# Altium schematic sheet Sheet1.SchDoc
size A3
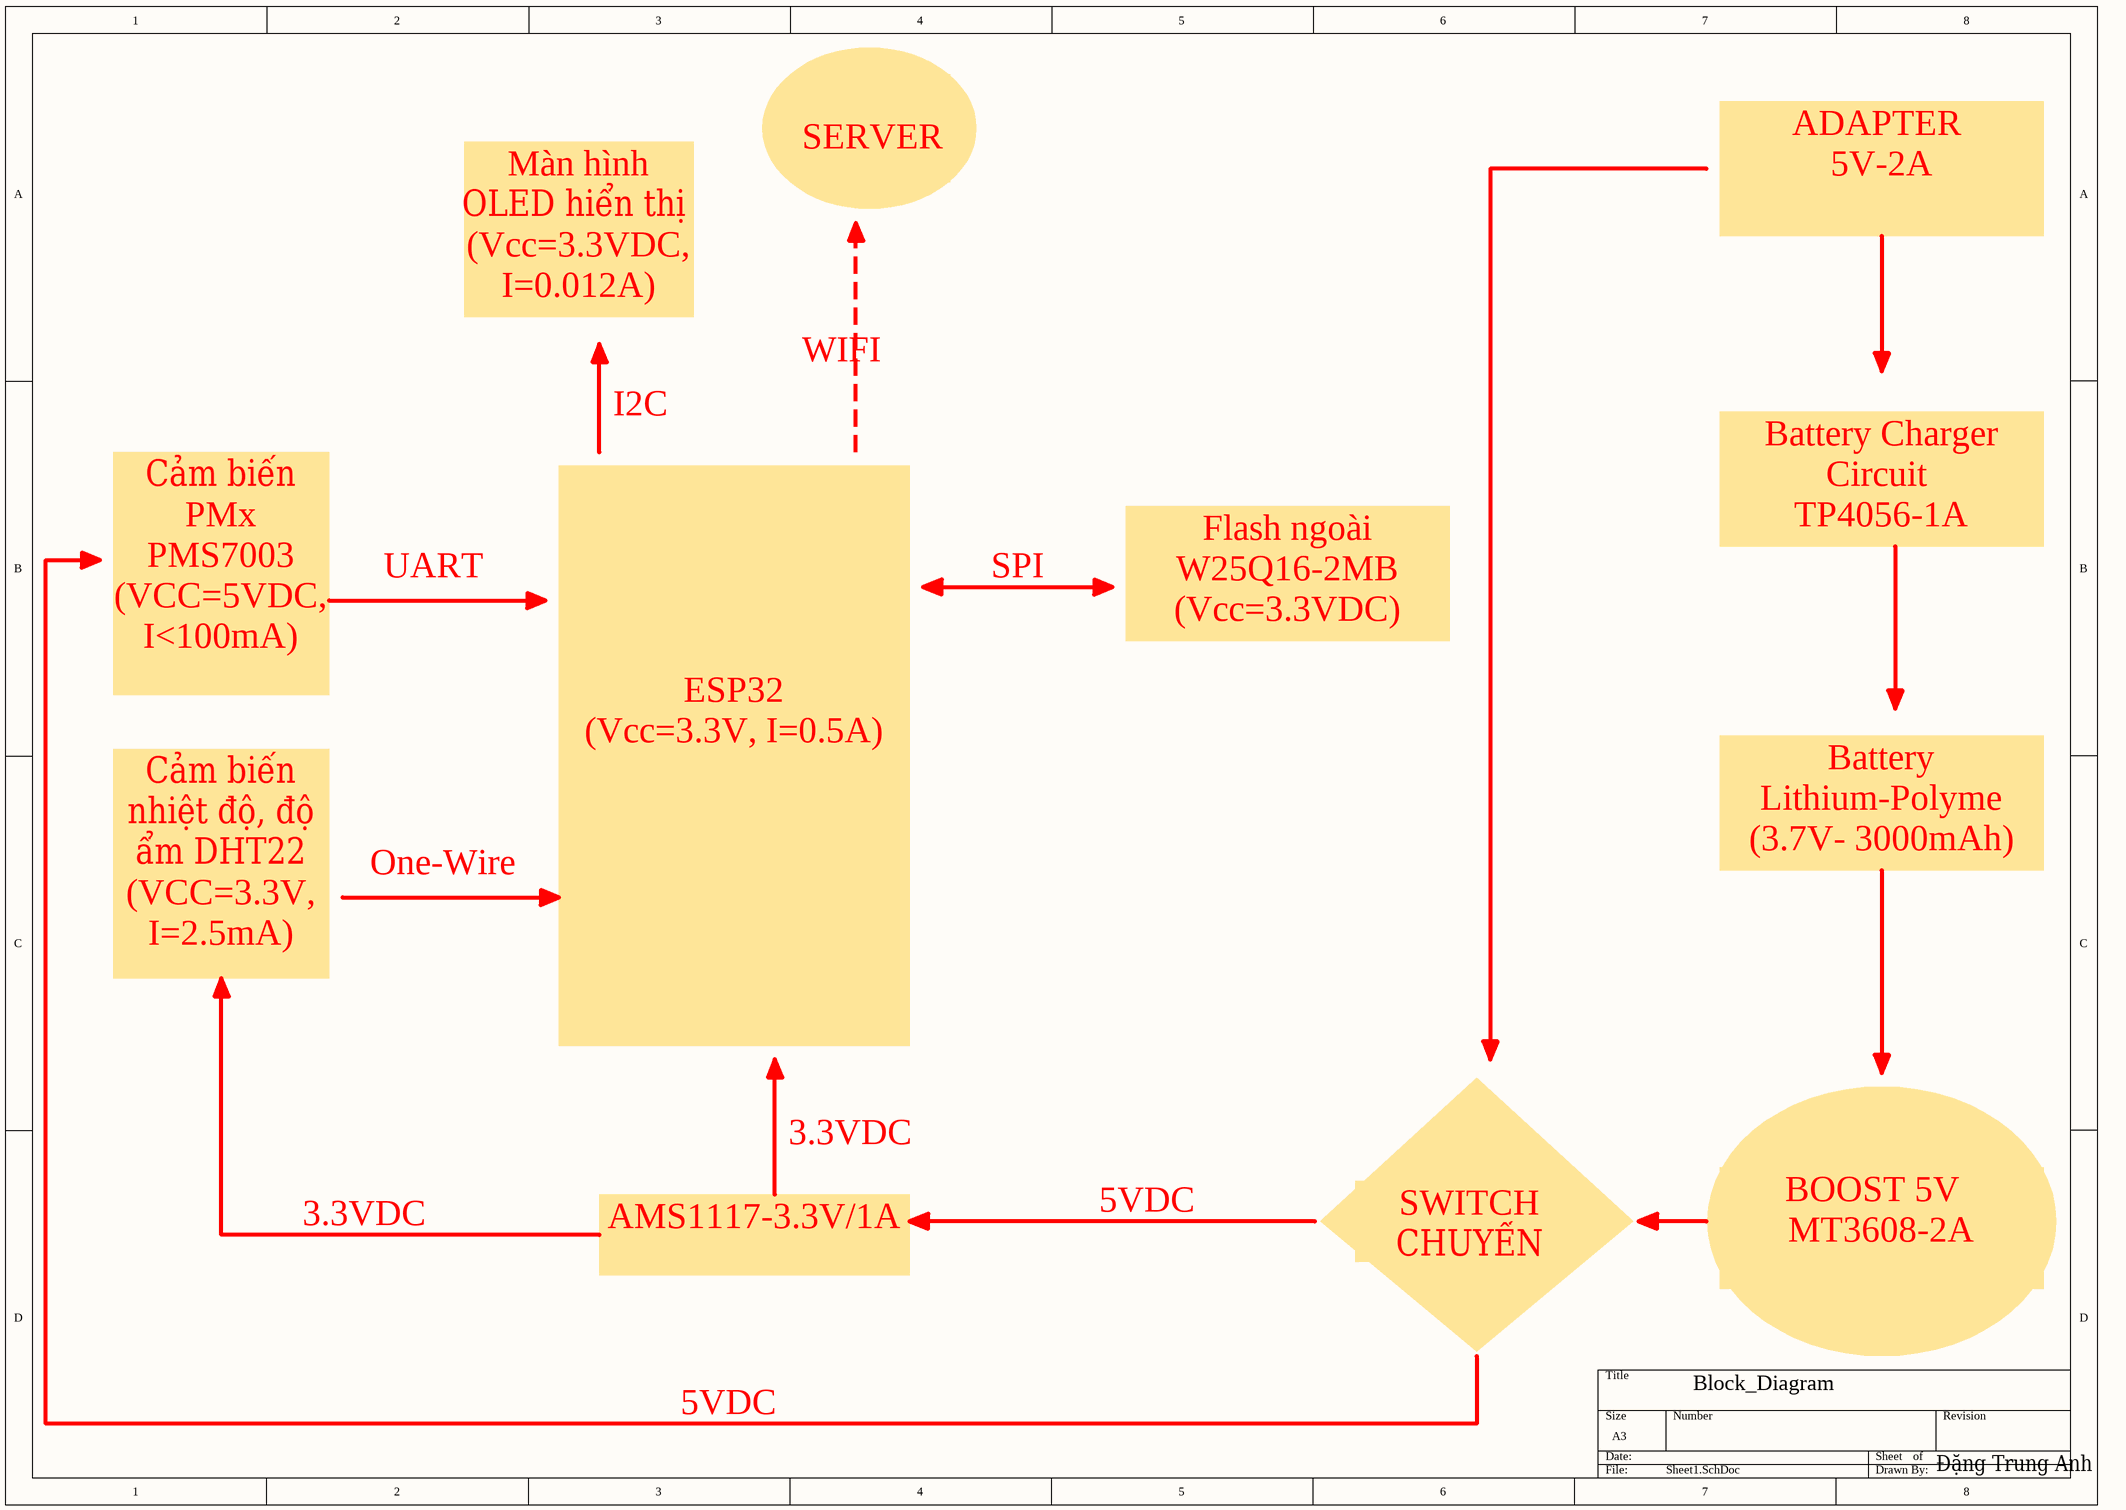
[diagram p0: Sheet1.SchDoc]

## Notes on the sheet
- SERVER
- ADAPTER
  5V-2A
- Màn hình OLED hiển thị
  (Vcc=3.3VDC, I=0.012A)
- WIFI
- I2C
- UART
- SPI
- Battery Charger Circuit
  TP4056-1A
- Flash ngoài
  W25Q16-2MB
  (Vcc=3.3VDC)
- Cảm biến PMx PMS7003
  (VCC=5VDC, I<100mA)
- One-Wire
- Battery Lithium-Polyme (3.7V- 3000mAh)
- Cảm biến nhiệt độ, độ ẩm DHT22 (VCC=3.3V, I=2.5mA)
- ESP32
  (Vcc=3.3V, I=0.5A)
- 3.3VDC
- 5VDC
- SWITCH CHUYỂN
- AMS1117-3.3V/1A
- BOOST 5V
  MT3608-2A
- Block_Diagram
- Đặng Trung Anh